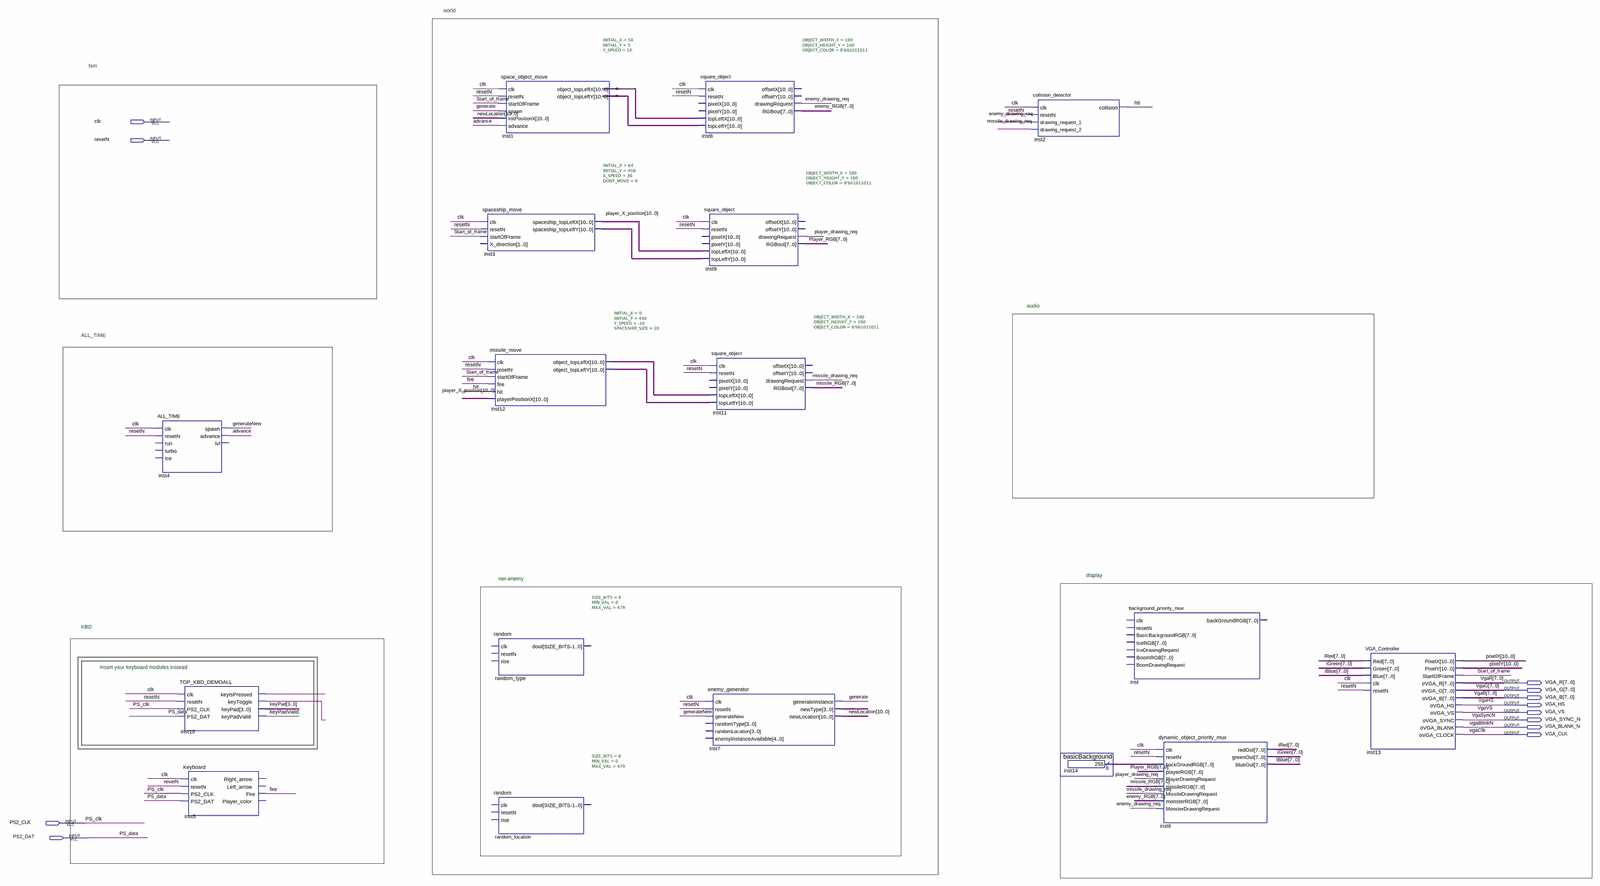
[diagram p0: schematic sheet, whole]
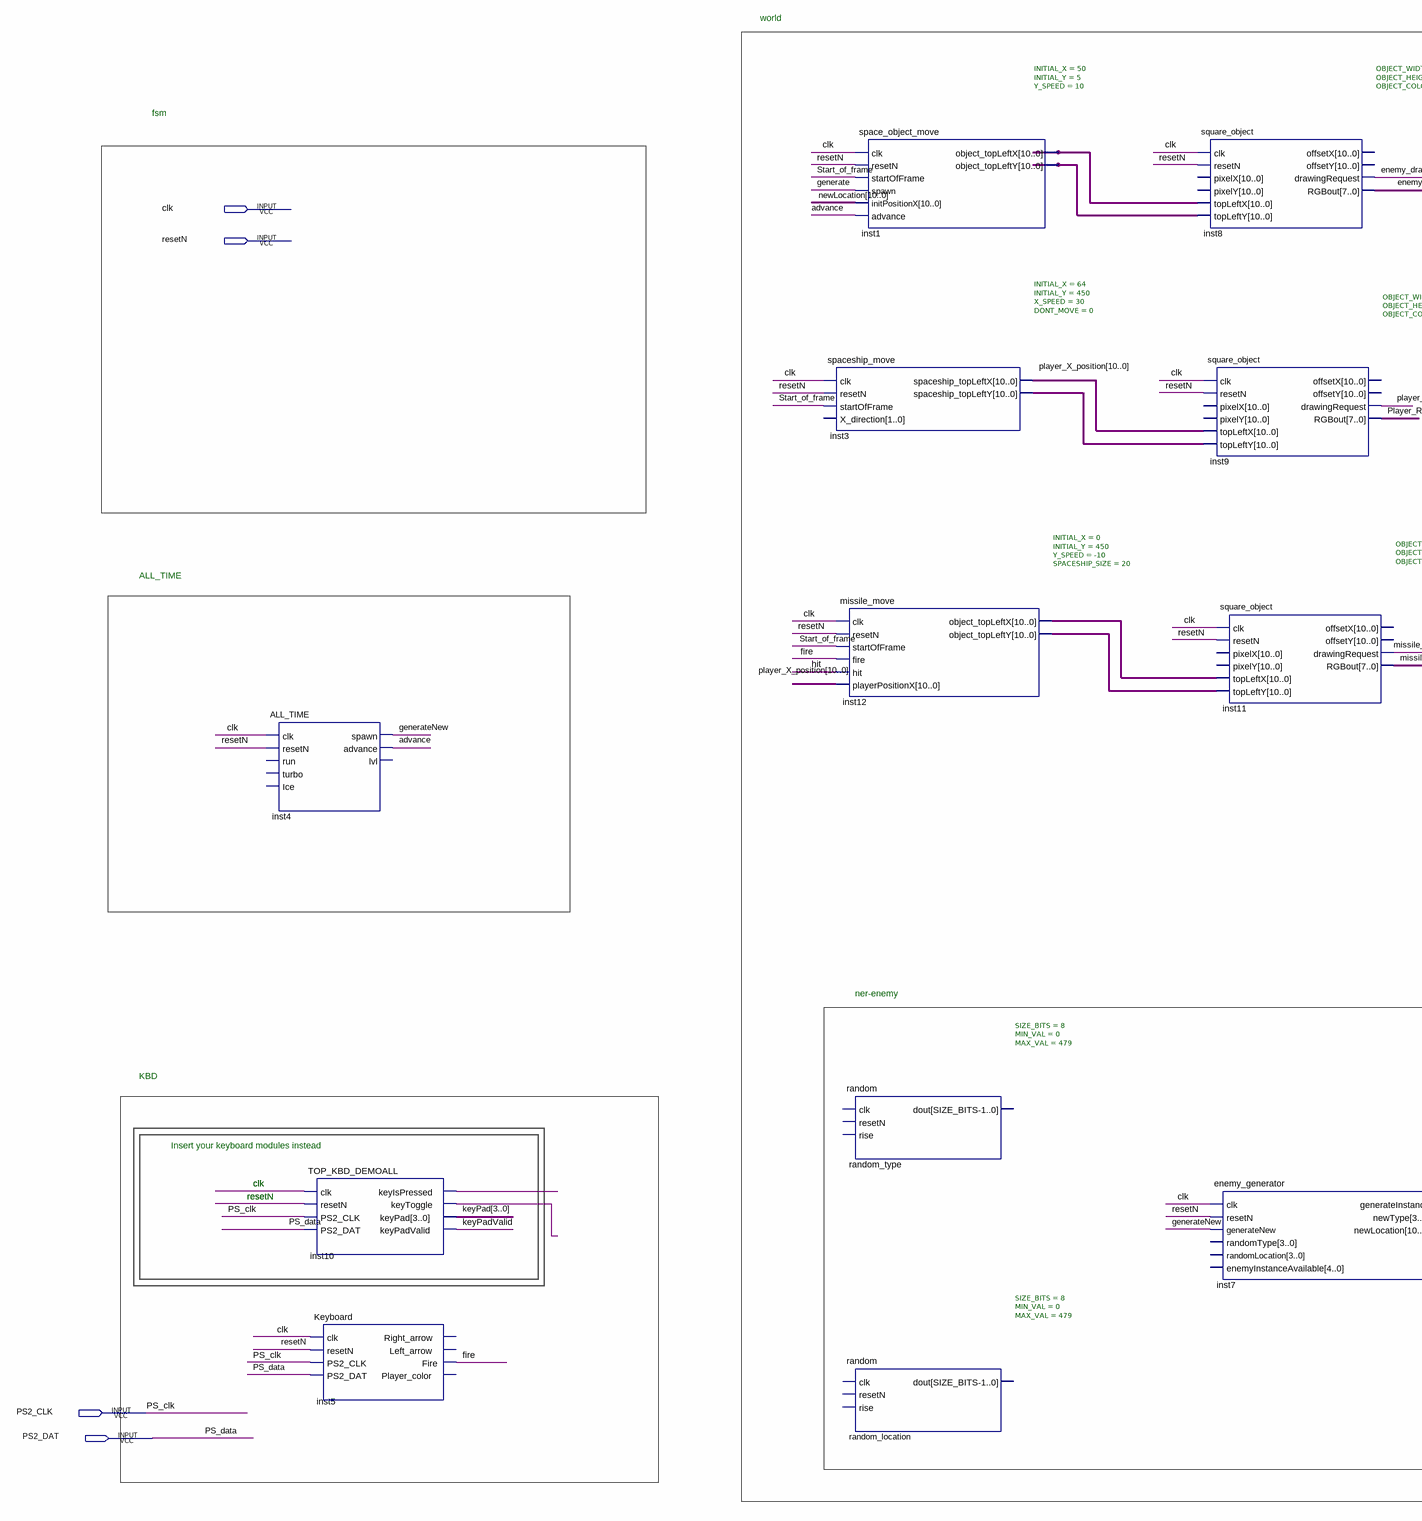
[diagram p1: schematic sheet, left part]
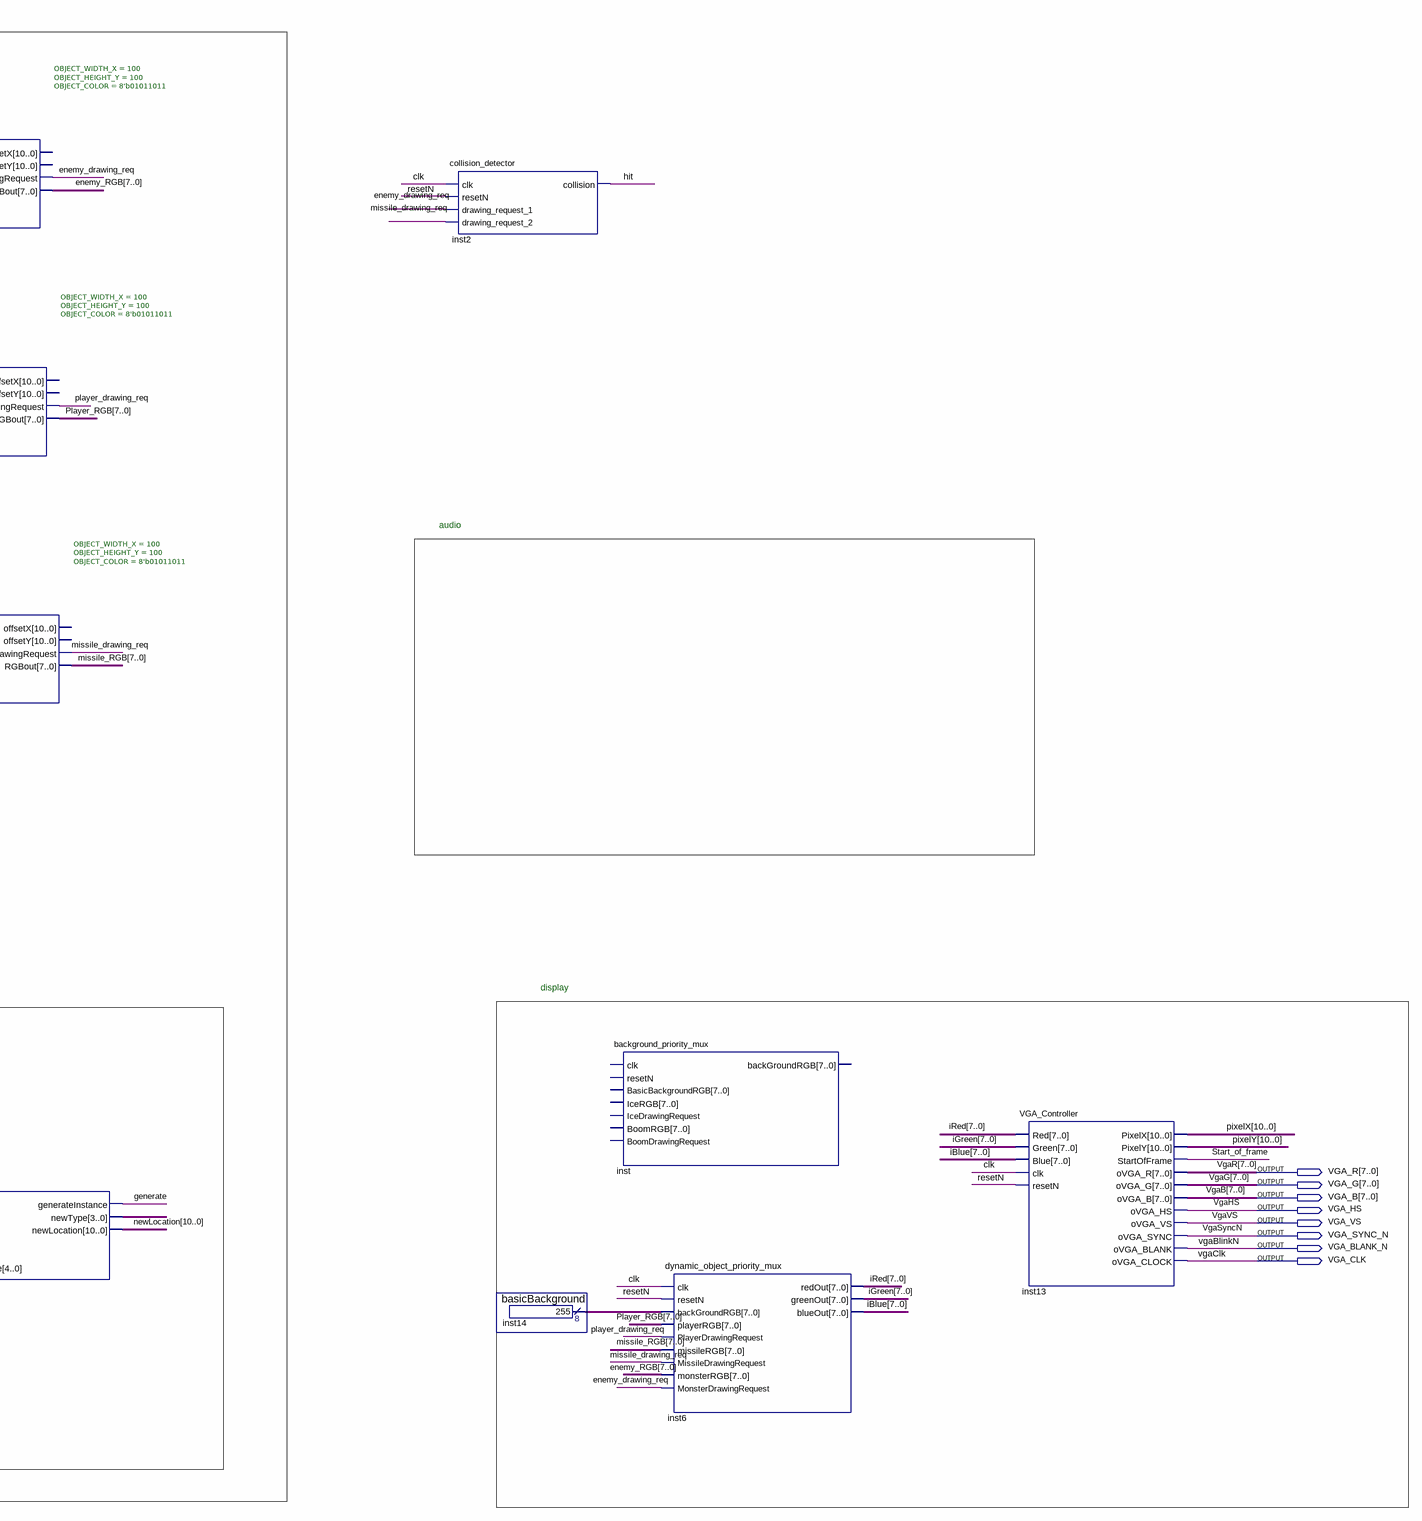
[diagram p2: schematic sheet, right part]
// Quartus schematic TOP_LVL.bdf as structural Verilog: 17 symbols, 12 pins
module TOP_LVL (
  input  clk,
  input  resetN,
  input  PS2_CLK,
  input  PS2_DAT,
  output [7:0] VGA_R,
  output [7:0] VGA_G,
  output [7:0] VGA_B,
  output VGA_HS,
  output VGA_VS,
  output VGA_SYNC_N,
  output VGA_BLANK_N,
  output VGA_CLK
);

  wire advance, enemy_drawing_req, fire, \generate , generateNew, hit, inst10_keyispressed, inst10_keytoggle,
       keyPadValid, missile_drawing_req, player_drawing_req, Start_of_frame;
  wire [3:0] inst7_newtype, keyPad;
  wire [7:0] enemy_RGB, iBlue, iGreen, inst14_result, iRed, missile_RGB, Player_RGB;
  wire [10:0] inst1_object_topleftx, inst1_object_toplefty, inst3_spaceship_toplefty, inst12_object_topleftx,
       inst12_object_toplefty, newLocation, pixelX, pixelY, player_X_position;

  ALL_TIME inst4 (.clk(clk), .resetN(resetN), .spawn(generateNew), .advance(advance));  // open: run, turbo, Ice, lvl
  TOP_KBD_DEMOALL inst10 (
    .clk(clk), .resetN(resetN), .PS2_CLK(PS2_CLK), .PS2_DAT(PS2_DAT), .keyIsPressed(inst10_keyispressed),
    .keyToggle(inst10_keytoggle), .keyPad(keyPad), .keyPadValid(keyPadValid));
  Keyboard inst5 (
    .clk(clk), .resetN(resetN), .PS2_CLK(PS2_CLK), .PS2_DAT(PS2_DAT), .Fire(fire));  // open: Right_arrow, Left_arrow, Player_color
  spaceship_move #(.INITIAL_X(64), .INITIAL_Y(450), .X_SPEED(30), .DONT_MOVE(0)) inst3 (
    .clk(clk), .resetN(resetN), .startOfFrame(Start_of_frame), .spaceship_topLeftX(player_X_position),
    .spaceship_topLeftY(inst3_spaceship_toplefty));  // open: X_direction
  space_object_move #(.INITIAL_X(50), .INITIAL_Y(5), .Y_SPEED(10)) inst1 (
    .clk(clk), .resetN(resetN), .startOfFrame(Start_of_frame), .spawn(\generate ),
    .initPositionX(newLocation), .advance(advance), .object_topLeftX(inst1_object_topleftx),
    .object_topLeftY(inst1_object_toplefty));
  missile_move #(.INITIAL_X(0), .INITIAL_Y(450), .Y_SPEED(-10), .SPACESHIP_SIZE(20)) inst12 (
    .clk(clk), .resetN(resetN), .startOfFrame(Start_of_frame), .fire(fire), .hit(hit),
    .playerPositionX(player_X_position), .object_topLeftX(inst12_object_topleftx),
    .object_topLeftY(inst12_object_toplefty));
  random #(.SIZE_BITS(8), .MIN_VAL(0), .MAX_VAL(479)) random_type ();  // open: clk, resetN, rise, dout
  random #(.SIZE_BITS(8), .MIN_VAL(0), .MAX_VAL(479)) random_location ();  // open: clk, resetN, rise, dout
  square_object #(.OBJECT_WIDTH_X(100), .OBJECT_HEIGHT_Y(100), .OBJECT_COLOR(8'b01011011)) inst8 (
    .clk(clk), .resetN(resetN), .topLeftX(inst1_object_topleftx), .topLeftY(inst1_object_toplefty),
    .drawingRequest(enemy_drawing_req), .RGBout(enemy_RGB));  // open: pixelX, pixelY, offsetX, offsetY
  square_object #(.OBJECT_WIDTH_X(100), .OBJECT_HEIGHT_Y(100), .OBJECT_COLOR(8'b01011011)) inst9 (
    .clk(clk), .resetN(resetN), .topLeftX(player_X_position), .topLeftY(inst3_spaceship_toplefty),
    .drawingRequest(player_drawing_req), .RGBout(Player_RGB));  // open: pixelX, pixelY, offsetX, offsetY
  square_object #(.OBJECT_WIDTH_X(100), .OBJECT_HEIGHT_Y(100), .OBJECT_COLOR(8'b01011011)) inst11 (
    .clk(clk), .resetN(resetN), .topLeftX(inst12_object_topleftx), .topLeftY(inst12_object_toplefty),
    .drawingRequest(missile_drawing_req), .RGBout(missile_RGB));  // open: pixelX, pixelY, offsetX, offsetY
  enemy_generator inst7 (
    .clk(clk), .resetN(resetN), .generateNew(generateNew), .generateInstance(\generate ),
    .newType(inst7_newtype), .newLocation(newLocation));  // open: randomType, randomLocation, enemyInstanceAvailable
  collision_detector inst2 (
    .clk(clk), .resetN(resetN), .drawing_request_1(enemy_drawing_req),
    .drawing_request_2(missile_drawing_req), .collision(hit));
  basicBackground inst14 (.result(inst14_result));
  background_priority_mux inst ();  // open: clk, resetN, BasicBackgroundRGB, IceRGB, IceDrawingRequest, BoomRGB, BoomDrawingRequest, backGroundRGB
  dynamic_object_priority_mux inst6 (
    .clk(clk), .resetN(resetN), .backGroundRGB(inst14_result), .playerRGB(Player_RGB),
    .PlayerDrawingRequest(player_drawing_req), .missileRGB(missile_RGB),
    .MissileDrawingRequest(missile_drawing_req), .monsterRGB(enemy_RGB),
    .MonsterDrawingRequest(enemy_drawing_req), .redOut(iRed), .greenOut(iGreen), .blueOut(iBlue));
  VGA_Controller inst13 (
    .Red(iRed), .Green(iGreen), .Blue(iBlue), .clk(clk), .resetN(resetN), .PixelX(pixelX), .PixelY(pixelY),
    .StartOfFrame(Start_of_frame), .oVGA_R(VGA_R), .oVGA_G(VGA_G), .oVGA_B(VGA_B), .oVGA_HS(VGA_HS),
    .oVGA_VS(VGA_VS), .oVGA_SYNC(VGA_SYNC_N), .oVGA_BLANK(VGA_BLANK_N), .oVGA_CLOCK(VGA_CLK));

  // Other names for the same wires on the sheet: PS_clk = PS2_CLK; PS_data = PS2_DAT; VgaB[7:0] = VGA_B;
  //   vgaBlinkN = VGA_BLANK_N; vgaClk = VGA_CLK; VgaG[7:0] = VGA_G; VgaHS = VGA_HS; VgaR[7:0] = VGA_R;
  //   VgaSyncN = VGA_SYNC_N; VgaVS = VGA_VS

  // Notes on the sheet:
  //   world
  //   fsm
  //   audio
  //   ALL_TIME
  //   display
  //   ner-enemy
  //   KBD
  //   Insert your keyboard modules instead
  //   clk
  //   resetN
endmodule
